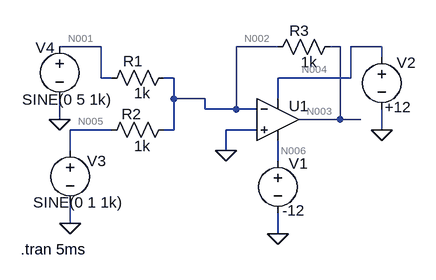
[diagram p0: schematic Inverting_adder_ac.asc]
Inverting_adder_ac.asc, the LTspice schematic file:
Version 4
SHEET 1 880 680
WIRE -32 48 -96 48
WIRE 240 48 176 48
WIRE 336 48 320 48
WIRE 400 48 352 48
WIRE 400 64 400 48
WIRE -32 96 -32 48
WIRE -16 96 -32 96
WIRE 80 96 64 96
WIRE 352 96 352 48
WIRE 352 96 240 96
WIRE 80 128 80 96
WIRE 128 128 80 128
WIRE 240 128 240 96
WIRE 128 144 128 128
WIRE 176 144 176 48
WIRE 176 144 128 144
WIRE 208 144 176 144
WIRE -96 160 -96 128
WIRE 336 160 336 48
WIRE 336 160 272 160
WIRE 368 160 336 160
WIRE -16 176 -80 176
WIRE 80 176 80 128
WIRE 80 176 64 176
WIRE 208 176 160 176
WIRE 400 176 400 144
WIRE -80 208 -80 176
WIRE 160 208 160 176
WIRE 240 224 240 192
WIRE -80 320 -80 288
WIRE 240 336 240 304
FLAG -96 160 0
FLAG -80 320 0
FLAG 240 336 0
FLAG 400 176 0
FLAG 160 208 0
SYMBOL Opamps\\UniversalOpamp2 240 160 R0
WINDOW 0 17 -21 Left 2
SYMATTR InstName U1
SYMBOL res 80 80 R90
WINDOW 0 6 63 VBottom 2
WINDOW 3 24 49 VTop 2
SYMATTR InstName R1
SYMATTR Value 1k
SYMBOL res 80 160 R90
WINDOW 0 7 65 VBottom 2
WINDOW 3 25 49 VTop 2
SYMATTR InstName R2
SYMATTR Value 1k
SYMBOL res 336 32 R90
WINDOW 0 7 63 VBottom 2
WINDOW 3 24 48 VTop 2
SYMATTR InstName R3
SYMATTR Value 1k
SYMBOL voltage 240 208 R0
WINDOW 0 17 20 Left 2
WINDOW 3 7 92 Left 2
WINDOW 123 0 0 Left 0
WINDOW 39 0 0 Left 0
SYMATTR InstName V1
SYMATTR Value -12
SYMBOL voltage 400 48 R0
WINDOW 0 23 24 Left 2
WINDOW 3 5 93 Left 2
WINDOW 123 0 0 Left 0
WINDOW 39 0 0 Left 0
SYMATTR InstName V2
SYMATTR Value +12
SYMBOL voltage -80 192 R0
WINDOW 0 26 32 Left 2
WINDOW 123 0 0 Left 0
WINDOW 39 0 0 Left 0
WINDOW 3 -57 96 Left 2
SYMATTR InstName V3
SYMATTR Value SINE(0 1 1k)
SYMBOL voltage -96 32 R0
WINDOW 0 -37 17 Left 2
WINDOW 3 -58 97 Left 2
WINDOW 123 0 0 Left 0
WINDOW 39 0 0 Left 0
SYMATTR InstName V4
SYMATTR Value SINE(0 5 1k)
TEXT -156 360 Left 2 !.tran 5ms

The netlist it stands for:
* Inverting_adder_ac.asc
XU1 0 N002 N004 N006 N003 level.2 Avol=1Meg GBW=10Meg Slew=10Meg ilimit=25m rail=0 Vos=0 phimargin=45 en=0 enk=0 in=0 ink=0 Rin=500Meg  ; pins IN+ IN- V+ V- OUT
R1 N002 N001 1k
R2 N002 N005 1k
R3 N003 N002 1k
V1 N006 0 -12
V2 N004 0 +12
V3 N005 0 SINE(0 1 1k)
V4 N001 0 SINE(0 5 1k)
.tran 5ms
.lib UniversalOpamps2.sub
.backanno
.end

* Results of the author's LTspice run, read from the files saved beside the schematic
* Operating Point, zero values left out:
*   V(n004) = 12 V
*   V(n006) = -12 V
*   I(V2) = -1.199 mA
*   I(V1) = 1.199 mA
*   Ix(u1:3) = 1.199 mA
*   Ix(u1:4) = -1.199 mA
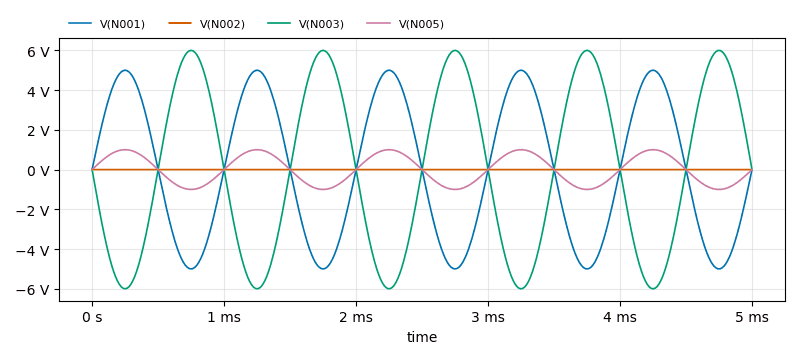
[diagram p1: Transient Analysis of Inverting_adder_ac.asc, plotted from the saved traces]
* Transient Analysis, 1 run:
*   V(N001): min -4.999 V, max 4.999 V, average -2.077 µV, rms 3.533 V, last 0 V
*   V(N002): min -606.8 µV, max 607.1 µV, average -9.434 nV, rms 428.6 µV, last 606.8 µV
*   V(N003): min -5.999 V, max 5.999 V, average 2.461 µV, rms 4.24 V, last 1.821 mV
*   V(N005): min -999.8 mV, max 999.8 mV, average -415.4 nV, rms 706.7 mV, last 0 V